# Altium schematic sheet 00_TOP.SchDoc
size A4; SheetNumber: 1; SheetTotal: 6
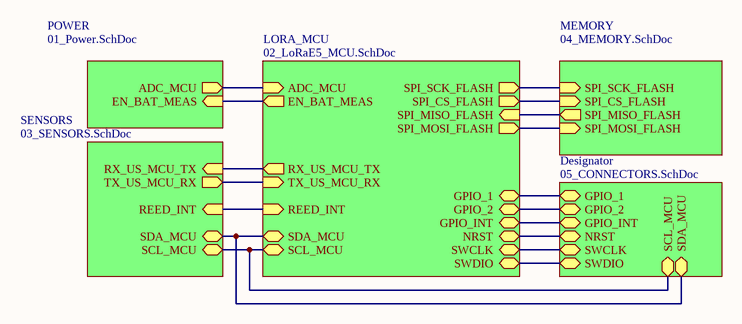
[diagram p0: 00_TOP.SchDoc]

## Sub-sheets
Designator = 05_CONNECTORS.SchDoc: SDA_MCU (bidir), SCL_MCU (bidir), GPIO_1 (bidir), GPIO_2 (bidir), GPIO_INT (bidir), SWCLK (bidir), SWDIO (bidir), NRST (bidir)
LORA_MCU = 02_LoRaE5_MCU.SchDoc: SCL_MCU (bidir), SDA_MCU (bidir), RX_US_MCU_TX (out), TX_US_MCU_RX (in), SPI_SCK_FLASH (out), SPI_MISO_FLASH (in), SPI_MOSI_FLASH (out), SPI_CS_FLASH (out), ADC_MCU (in), EN_BAT_MEAS (out), SWCLK (bidir), SWDIO (bidir), GPIO_1 (bidir), GPIO_2 (bidir), GPIO_INT (bidir), REED_INT (in), NRST (bidir)
MEMORY = 04_MEMORY.SchDoc: SPI_MISO_FLASH (out), SPI_MOSI_FLASH (in), SPI_SCK_FLASH (in), SPI_CS_FLASH (in)
POWER = 01_Power.SchDoc: ADC_MCU (out), EN_BAT_MEAS (in)
SENSORS = 03_SENSORS.SchDoc: RX_US_MCU_TX (in), TX_US_MCU_RX (out), SDA_MCU (bidir), SCL_MCU (bidir), REED_INT (in)

## Nets
(unnamed): sheet POWER/ADC_MCU, sheet LORA_MCU/ADC_MCU
(unnamed): sheet POWER/EN_BAT_MEAS, sheet LORA_MCU/EN_BAT_MEAS
(unnamed): sheet LORA_MCU/SCL_MCU, sheet SENSORS/SCL_MCU, sheet Designator/SCL_MCU
(unnamed): sheet LORA_MCU/SDA_MCU, sheet SENSORS/SDA_MCU, sheet Designator/SDA_MCU
(unnamed): sheet LORA_MCU/RX_US_MCU_TX, sheet SENSORS/RX_US_MCU_TX
(unnamed): sheet LORA_MCU/TX_US_MCU_RX, sheet SENSORS/TX_US_MCU_RX
(unnamed): sheet LORA_MCU/SPI_SCK_FLASH, sheet MEMORY/SPI_SCK_FLASH
(unnamed): sheet LORA_MCU/SPI_MISO_FLASH, sheet MEMORY/SPI_MISO_FLASH
(unnamed): sheet LORA_MCU/SPI_MOSI_FLASH, sheet MEMORY/SPI_MOSI_FLASH
(unnamed): sheet LORA_MCU/SPI_CS_FLASH, sheet MEMORY/SPI_CS_FLASH
(unnamed): sheet LORA_MCU/SWCLK, sheet Designator/SWCLK
(unnamed): sheet LORA_MCU/SWDIO, sheet Designator/SWDIO
(unnamed): sheet LORA_MCU/GPIO_1, sheet Designator/GPIO_1
(unnamed): sheet LORA_MCU/GPIO_2, sheet Designator/GPIO_2
(unnamed): sheet LORA_MCU/GPIO_INT, sheet Designator/GPIO_INT
(unnamed): sheet LORA_MCU/REED_INT, sheet SENSORS/REED_INT
(unnamed): sheet LORA_MCU/NRST, sheet Designator/NRST